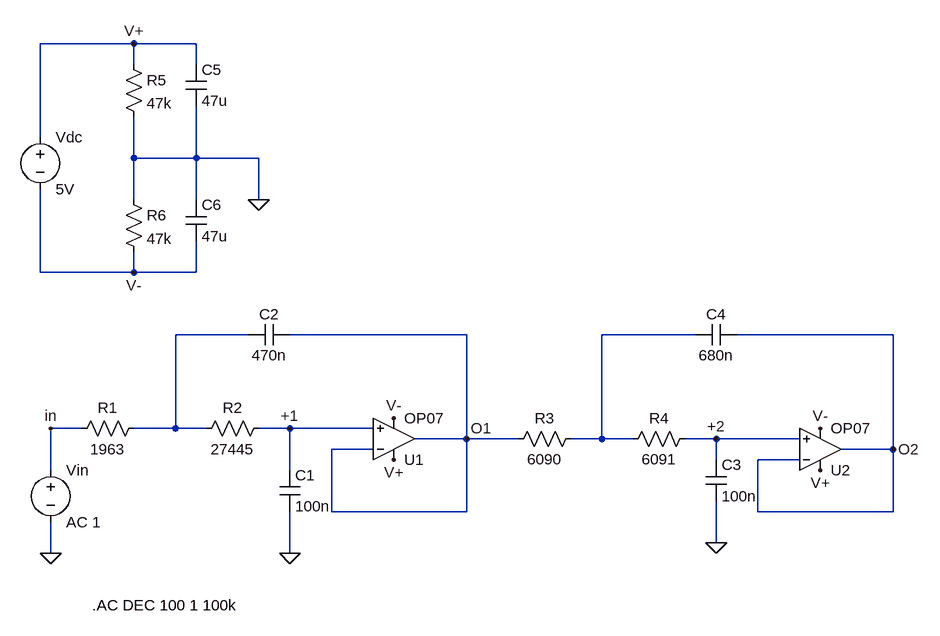
[diagram p0: schematic PWFilter_exact_value.asc]
PWFilter_exact_value.asc, the LTspice schematic file:
Version 4
SHEET 1 992 680
WIRE -208 -400 -352 -400
WIRE -112 -400 -208 -400
WIRE -208 -368 -208 -400
WIRE -112 -368 -112 -400
WIRE -352 -256 -352 -400
WIRE -208 -224 -208 -288
WIRE -112 -224 -112 -304
WIRE -112 -224 -208 -224
WIRE -16 -224 -112 -224
WIRE -208 -160 -208 -224
WIRE -112 -160 -112 -224
WIRE -16 -160 -16 -224
WIRE -352 -48 -352 -176
WIRE -208 -48 -208 -80
WIRE -208 -48 -352 -48
WIRE -112 -48 -112 -96
WIRE -112 -48 -208 -48
WIRE -32 48 -144 48
WIRE 304 48 32 48
WIRE 656 48 512 48
WIRE 960 48 720 48
WIRE -288 192 -336 192
WIRE -144 192 -144 48
WIRE -144 192 -208 192
WIRE -96 192 -144 192
WIRE 32 192 -16 192
WIRE 160 192 32 192
WIRE 304 208 304 48
WIRE 304 208 224 208
WIRE 384 208 304 208
WIRE 512 208 512 48
WIRE 512 208 464 208
WIRE 560 208 512 208
WIRE 688 208 640 208
WIRE 816 208 688 208
WIRE 160 224 96 224
WIRE 960 224 960 48
WIRE 960 224 880 224
WIRE 688 240 688 208
WIRE 816 240 752 240
WIRE -336 256 -336 192
WIRE 32 256 32 192
WIRE 96 320 96 224
WIRE 304 320 304 208
WIRE 304 320 96 320
WIRE 752 320 752 240
WIRE 960 320 960 224
WIRE 960 320 752 320
WIRE 688 368 688 304
WIRE -336 384 -336 336
WIRE 32 384 32 320
FLAG 32 384 0
FLAG -336 384 0
FLAG 688 368 0
FLAG -336 192 in
FLAG 32 192 +1
FLAG 688 208 +2
FLAG 304 208 O1
FLAG 960 224 O2
FLAG -16 -160 0
FLAG -208 -400 V+
FLAG -208 -48 V-
FLAG 192 240 V+
FLAG 848 256 V+
FLAG 192 176 V-
FLAG 848 192 V-
SYMBOL Opamps\\OP07 192 272 M180
SYMATTR InstName U1
SYMBOL Opamps\\OP07 848 288 M180
SYMATTR InstName U2
SYMBOL res -192 176 R90
WINDOW 0 0 56 VBottom 2
WINDOW 3 32 56 VTop 2
SYMATTR InstName R1
SYMATTR Value 1963
SYMBOL res 0 176 R90
WINDOW 0 0 56 VBottom 2
WINDOW 3 32 56 VTop 2
SYMATTR InstName R2
SYMATTR Value 27445
SYMBOL res 480 192 R90
WINDOW 0 0 56 VBottom 2
WINDOW 3 32 56 VTop 2
SYMATTR InstName R3
SYMATTR Value 6090
SYMBOL cap 16 256 R0
SYMATTR InstName C1
SYMATTR Value 100n
SYMBOL cap 32 32 R90
WINDOW 0 0 32 VBottom 2
WINDOW 3 32 32 VTop 2
SYMATTR InstName C2
SYMATTR Value 470n
SYMBOL voltage -336 240 R0
SYMATTR InstName Vin
SYMATTR Value AC 1
SYMBOL res 656 192 R90
WINDOW 0 0 56 VBottom 2
WINDOW 3 32 56 VTop 2
SYMATTR InstName R4
SYMATTR Value 6091
SYMBOL cap 672 240 R0
SYMATTR InstName C3
SYMATTR Value 100n
SYMBOL cap 720 32 R90
WINDOW 0 0 32 VBottom 2
WINDOW 3 32 32 VTop 2
SYMATTR InstName C4
SYMATTR Value 680n
SYMBOL voltage -352 -272 R0
SYMATTR InstName Vdc
SYMATTR Value 5V
SYMBOL res -224 -384 R0
SYMATTR InstName R5
SYMATTR Value 47k
SYMBOL res -224 -176 R0
SYMATTR InstName R6
SYMATTR Value 47k
SYMBOL cap -128 -368 R0
SYMATTR InstName C5
SYMATTR Value 47u
SYMBOL cap -128 -160 R0
SYMATTR InstName C6
SYMATTR Value 47u
TEXT -272 464 Left 2 !.AC DEC 100 1 100k

The netlist it stands for:
* PWFilter_exact_value.asc
XU1 +1 O1 V+ V- O1 LT1001  ; OP07, pins In+ In- V+ V- OUT
XU2 +2 O2 V+ V- O2 LT1001  ; OP07, pins In+ In- V+ V- OUT
R1 N001 in 1963
R2 +1 N001 27445
R3 N002 O1 6090
C1 +1 0 100n
C2 O1 N001 470n
Vin in 0 AC 1
R4 +2 N002 6091
C3 +2 0 100n
C4 O2 N002 680n
Vdc V+ V- 5V
R5 V+ 0 47k
R6 0 V- 47k
C5 V+ 0 47u
C6 0 V- 47u
.AC DEC 100 1 100k
.lib LTC.lib
.backanno
.end